# EAGLE design MineralFire-0.3-smd (EAGLE 8.7.0)
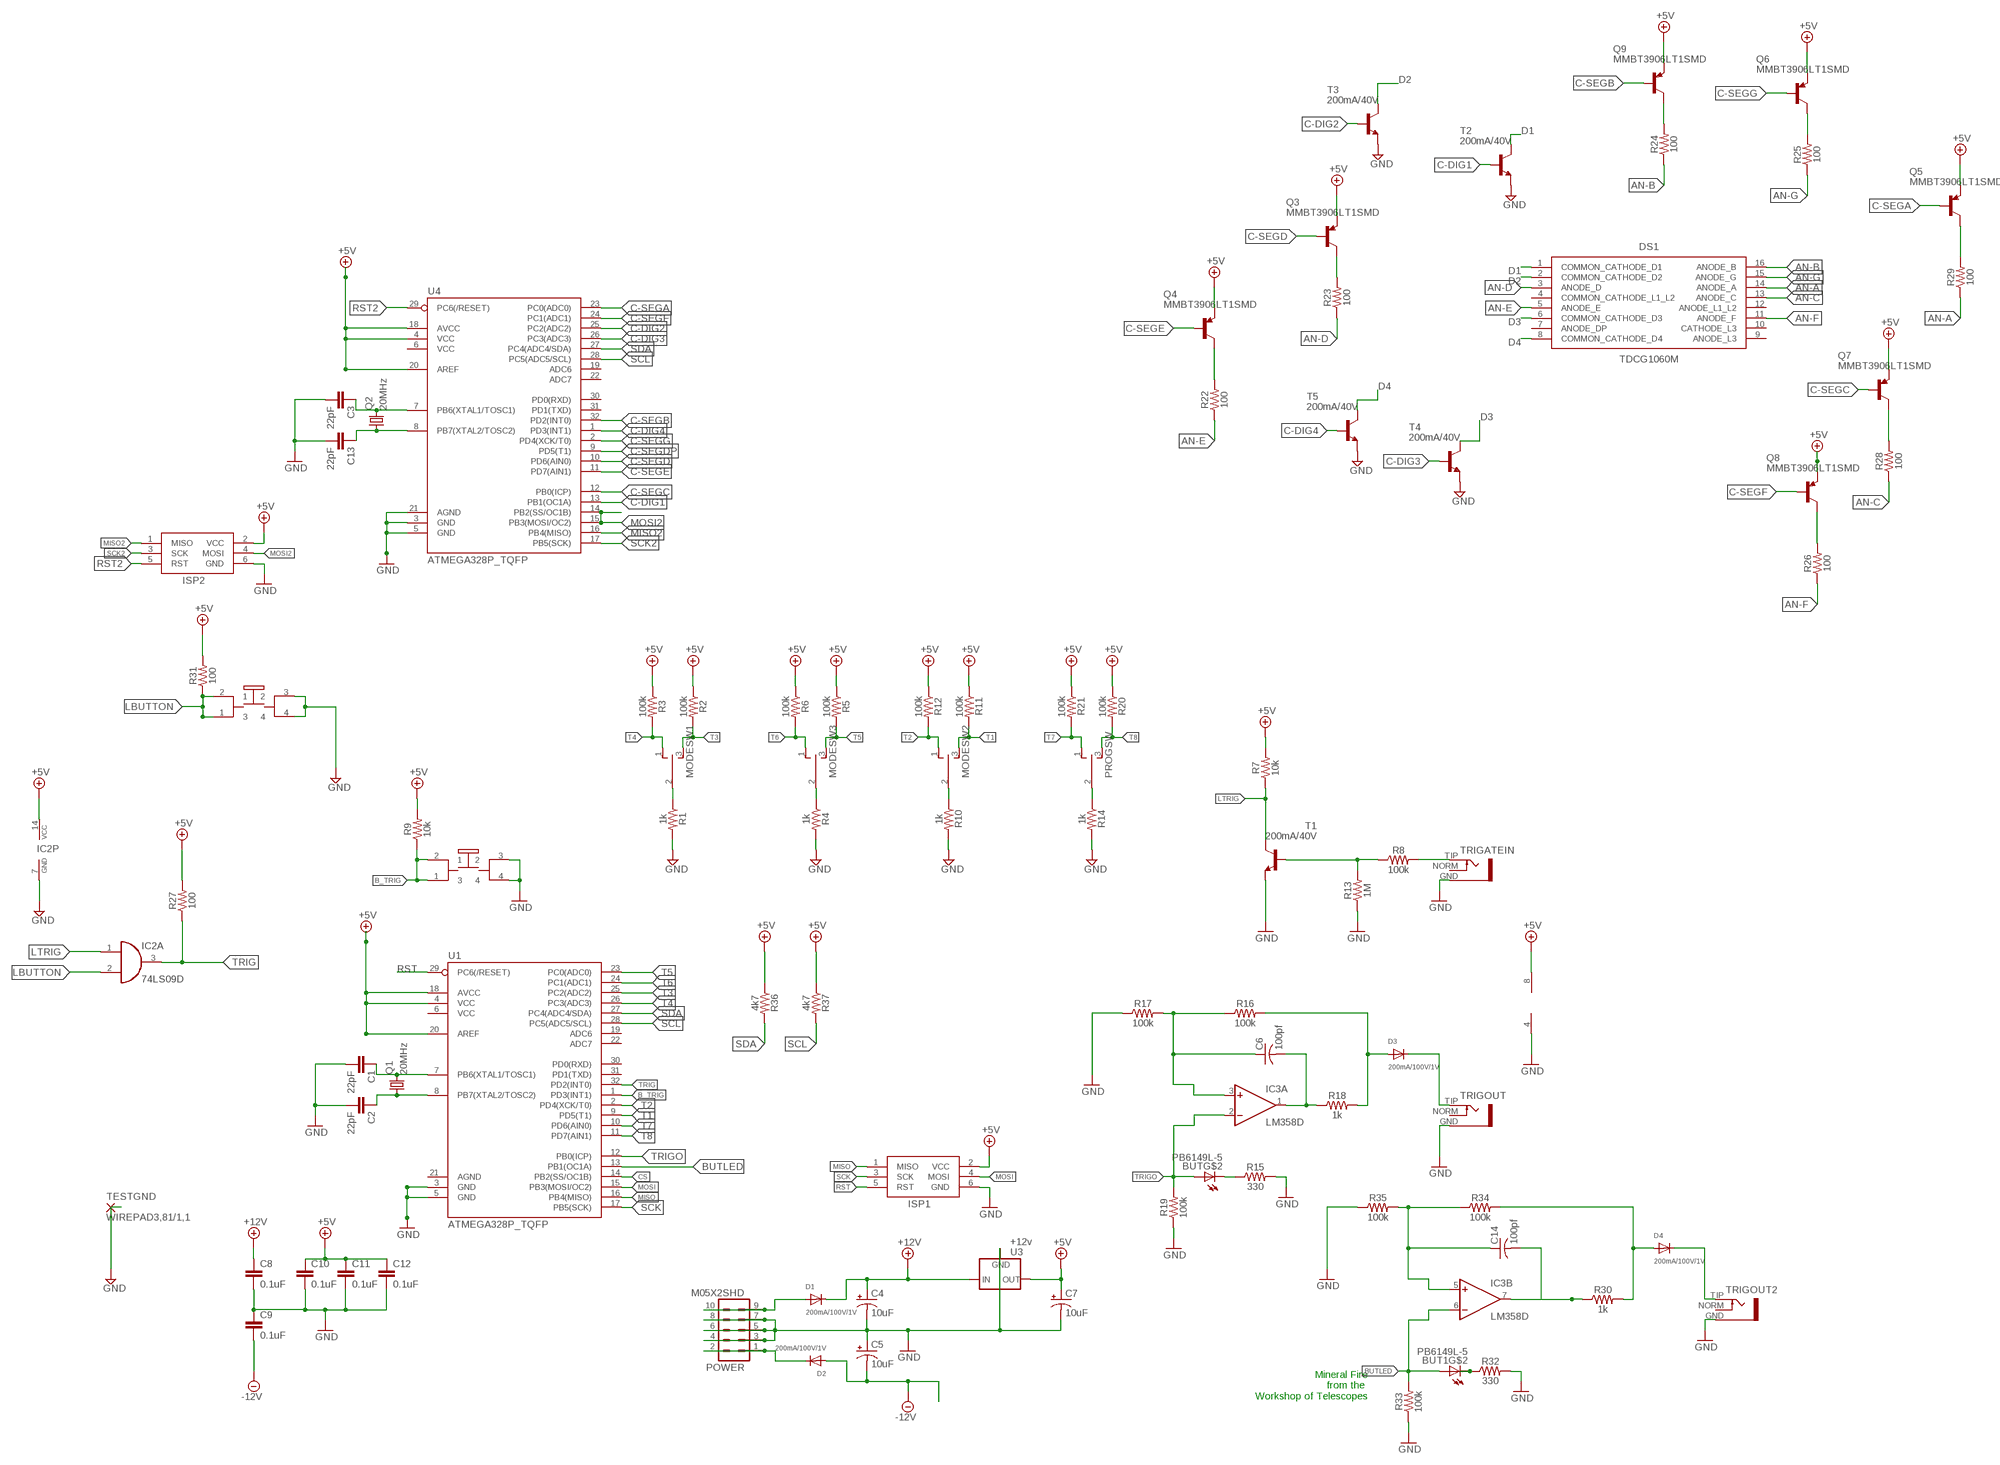
[diagram p0: schematic, sheet 1]

## Parts
BUT  PB6149L-5  [PB6149L]
BUT1  PB6149L-5  [PB6149L]
C1  22pF  22PF-0603-50V-5%  [0603]
C2  22pF  22PF-0603-50V-5%  [0603]
C3  22pF  22PF-0603-50V-5%  [0603]
C4  10uF  CPOL-US153CLV-0505  [153CLV-0505]
C5  10uF  CPOL-US153CLV-0505  [153CLV-0505]
C6  100pf  C-USC0805K  [C0805K]
C7  10uF  CPOL-US153CLV-0505  [153CLV-0505]
C8  0.1uF  0.1UF-0603-100V-10%  [0603]
C9  0.1uF  0.1UF-0603-100V-10%  [0603]
C10  0.1uF  0.1UF-0603-100V-10%  [0603]
C11  0.1uF  0.1UF-0603-100V-10%  [0603]
C12  0.1uF  0.1UF-0603-100V-10%  [0603]
C13  22pF  22PF-0603-50V-5%  [0603]
C14  100pf  C-USC0805K  [C0805K]
D1  200mA/100V/1V  DIODESMA  [SMADIODE]
D2  200mA/100V/1V  DIODESMA  [SMADIODE]
D3  200mA/100V/1V  DIODESMA  [SMADIODE]
D4  200mA/100V/1V  DIODESMA  [SMADIODE]
DS1  TDCG1060M  [DIPS1016W50P254L4020H700Q16N]
IC2  74LS09D  [SO14]
IC3  LM358D  [SO08]
ISP1  AVRISP-6  [AVRISP]
ISP2  AVRISP-6  [AVRISP]
MODESW1  TOGGLE_ON_OFF_ON  [TOGGLE_ON_OFF_ON]
MODESW2  TOGGLE_ON_OFF_ON  [TOGGLE_ON_OFF_ON]
MODESW3  TOGGLE_ON_OFF_ON  [TOGGLE_ON_OFF_ON]
POWER  M05X2SHD  [2X5-SHROUDED]
PROGSW  TOGGLE_ON_OFF_ON  [TOGGLE_ON_OFF_ON]
Q1  20MHz  CRYSTALHC49UP  [HC49UP]
Q2  20MHz  CRYSTALHC49UP  [HC49UP]
Q3  MMBT3906LT1SMD  [SOT23-BEC]
Q4  MMBT3906LT1SMD  [SOT23-BEC]
Q5  MMBT3906LT1SMD  [SOT23-BEC]
Q6  MMBT3906LT1SMD  [SOT23-BEC]
Q7  MMBT3906LT1SMD  [SOT23-BEC]
Q8  MMBT3906LT1SMD  [SOT23-BEC]
Q9  MMBT3906LT1SMD  [SOT23-BEC]
R1  1k  1KOHM-0603-1/10W-1%  [0603]
R2  100k  100KOHM-0603-1/10W-1%  [0603]
R3  100k  100KOHM-0603-1/10W-1%  [0603]
R4  1k  1KOHM-0603-1/10W-1%  [0603]
R5  100k  100KOHM-0603-1/10W-1%  [0603]
R6  100k  100KOHM-0603-1/10W-1%  [0603]
R7  10k  10KOHM-0603-1/10W-1%  [0603]
R8  100k  100KOHM-0603-1/10W-1%  [0603]
R9  10k  10KOHM-0603-1/10W-1%  [0603]
R10  1k  1KOHM-0603-1/10W-1%  [0603]
R11  100k  100KOHM-0603-1/10W-1%  [0603]
R12  100k  100KOHM-0603-1/10W-1%  [0603]
R13  1M  1MOHM-0603-1/4W-5%  [0603]
R14  1k  1KOHM-0603-1/10W-1%  [0603]
R15  330  330OHM-0603-1/10W-1%  [0603]
R16  100k  100KOHM-0603-1/10W-1%  [0603]
R17  100k  100KOHM-0603-1/10W-1%  [0603]
R18  1k  1KOHM-0603-1/10W-1%  [0603]
R19  100k  100KOHM-0603-1/10W-1%  [0603]
R20  100k  100KOHM-0603-1/10W-1%  [0603]
R21  100k  100KOHM-0603-1/10W-1%  [0603]
R22  100  100OHM-0603-1/10W-1%  [0603]
R23  100  100OHM-0603-1/10W-1%  [0603]
R24  100  100OHM-0603-1/10W-1%  [0603]
R25  100  100OHM-0603-1/10W-1%  [0603]
R26  100  100OHM-0603-1/10W-1%  [0603]
R27  100  100OHM-0603-1/10W-1%  [0603]
R28  100  100OHM-0603-1/10W-1%  [0603]
R29  100  100OHM-0603-1/10W-1%  [0603]
R30  1k  1KOHM-0603-1/10W-1%  [0603]
R31  100  100OHM-0603-1/10W-1%  [0603]
R32  330  330OHM-0603-1/10W-1%  [0603]
R33  100k  100KOHM-0603-1/10W-1%  [0603]
R34  100k  100KOHM-0603-1/10W-1%  [0603]
R35  100k  100KOHM-0603-1/10W-1%  [0603]
R36  4k7  1KOHM-0603-1/10W-1%  [0603]
R37  4k7  1KOHM-0603-1/10W-1%  [0603]
T1  200mA/40V  MMBT3904LT1-NPN-SOT23-BEC  [SOT23-BEC]
T2  200mA/40V  MMBT3904LT1-NPN-SOT23-BEC  [SOT23-BEC]
T3  200mA/40V  MMBT3904LT1-NPN-SOT23-BEC  [SOT23-BEC]
T4  200mA/40V  MMBT3904LT1-NPN-SOT23-BEC  [SOT23-BEC]
T5  200mA/40V  MMBT3904LT1-NPN-SOT23-BEC  [SOT23-BEC]
TESTGND  WIREPAD3,81/1,1  [3,81/1,1]
TRIGATEIN  S_JACK  [S_JACK]
TRIGOUT  S_JACK  [S_JACK]
TRIGOUT2  S_JACK  [S_JACK]
U1  ATMEGA328P_TQFP  [TQFP32-08]
U3  +12v  V_REG_78XX7812  [TO-252]
U4  ATMEGA328P_TQFP  [TQFP32-08]

## Nets
+5V [Power]: C7.+ C10.1 C11.1 C12.1 IC2.14(P:VCC) IC3.8(P:V+) ISP1.2(VCC) ISP2.2(VCC) Q3.E Q4.E Q5.E Q6.E Q7.E Q8.E Q9.E R2.1 R3.1 R5.1 R6.1 R7.2 R9.2 R11.1 R12.1 R20.1 R21.1 R27.2 R31.2 R36.1 R37.1 U1.4(VCC) U1.18(AVCC) U1.20(AREF) U3.2(OUT) U4.4(VCC) U4.18(AVCC) U4.20(AREF)
+12V [Power]: C4.+ C8.1 D1.C U3.1(IN)
-12V [Power]: C5.- C9.2 D2.A
AN-A: DS1.14(ANODE_A) R29.1
AN-B: DS1.16(ANODE_B) R24.1
AN-C: DS1.13(ANODE_C) R28.1
AN-D: DS1.3(ANODE_D) R23.1
AN-E: DS1.5(ANODE_E) R22.1
AN-F: DS1.11(ANODE_F) R26.1
AN-G: DS1.15(ANODE_G) R25.1
B_TRIG: BUT.1 BUT.2 R9.1 U1.1(PD3(INT1))
BUTLED: BUT1.A IC3.6(B:-IN) R33.2 U1.13(PB1(OC1A))
C-DIG1: T2.B U4.13(PB1(OC1A))
C-DIG2: T3.B U4.25(PC2(ADC2))
C-DIG3: T4.B U4.26(PC3(ADC3))
C-DIG4: T5.B U4.1(PD3(INT1))
C-SEGA: Q5.B U4.23(PC0(ADC0))
C-SEGB: Q9.B U4.32(PD2(INT0))
C-SEGC: Q7.B U4.12(PB0(ICP))
C-SEGD: Q3.B U4.10(PD6(AIN0))
C-SEGDP: U4.9(PD5(T1))
C-SEGE: Q4.B U4.11(PD7(AIN1))
C-SEGF: Q8.B U4.24(PC1(ADC1))
C-SEGG: Q6.B U4.2(PD4(XCK/T0))
CS: U1.14(PB2(SS/OC1B))
D1: DS1.1(COMMON_CATHODE_D1) T2.C
D2: DS1.2(COMMON_CATHODE_D2) T3.C
D3: DS1.6(COMMON_CATHODE_D3) T4.C
D4: DS1.8(COMMON_CATHODE_D4) T5.C
GND [Power]: BUT1.3 BUT1.4 BUT.3 BUT.4 C1.2 C2.2 C3.2 C4.- C5.+ C7.- C8.2 C9.1 C10.2 C11.2 C12.2 C13.2 IC2.7(P:GND) IC3.4(P:V-) ISP1.6(GND) ISP2.6(GND) POWER.3 POWER.4 POWER.5 POWER.6 POWER.7 POWER.8 R1.2 R4.2 R10.2 R13.1 R14.2 R15.2 R17.1 R19.1 R32.2 R33.1 R35.1 T1.E T2.E T3.E T4.E T5.E TESTGND.1(P) TRIGATEIN.GND TRIGOUT2.GND TRIGOUT.GND U1.3(GND) U1.5(GND) U3.3(GND) U4.3(GND) U4.5(GND) U4.21(AGND)
LBUTTON [Power]: BUT1.1 BUT1.2 IC2.2(A:I1) R31.1
LTRIG: IC2.1(A:I0) R7.1 T1.C
MISO: ISP1.1(MISO) U1.16(PB4(MISO))
MISO2: ISP2.1(MISO) U4.16(PB4(MISO))
MOSI: ISP1.4(MOSI) U1.15(PB3(MOSI/OC2))
MOSI2: ISP2.4(MOSI) U4.14(PB2(SS/OC1B)) U4.15(PB3(MOSI/OC2))
N$1: C1.1 Q1.2 U1.7(PB6(XTAL1/TOSC1))
N$2: C2.1 Q1.1 U1.8(PB7(XTAL2/TOSC2))
N$3: MODESW1.2(P) R1.1
N$4: MODESW3.2(P) R4.1
N$5: Q4.C R22.2
N$6: PROGSW.2(P) R14.1
N$7: C3.1 Q2.2 U4.7(PB6(XTAL1/TOSC1))
N$8: C13.1 Q2.1 U4.8(PB7(XTAL2/TOSC2))
N$9: D1.A POWER.9 POWER.10
N$10: D2.C POWER.1 POWER.2
N$11: Q3.C R23.2
N$12: MODESW2.2(P) R10.1
N$13: Q9.C R24.2
N$14: Q8.C R26.2
N$15: R8.1 R13.2 T1.B
N$16: Q7.C R28.2
N$17: Q6.C R25.2
N$18: R8.2 TRIGATEIN.TIP
N$19: IC3.7(B:OUT) R30.1
N$20: Q5.C R29.2
N$21: BUT1.K(C) R32.1
N$22: D4.A R30.2
N$23: D4.C TRIGOUT2.TIP
N$24: C14.1 IC3.5(B:+IN) R34.1 R35.2
N$25: C14.2
N$26: R34.2
N$31: BUT.K(C) R15.1
N$32: C6.1 IC3.3(A:+IN) R16.1 R17.2
N$33: C6.2 IC3.1(A:OUT) R18.1
N$34: D3.A R16.2 R18.2
N$74: D3.C TRIGOUT.TIP
RST: ISP1.5(RST) U1.29(PC6(/RESET))
RST2: ISP2.5(RST) U4.29(PC6(/RESET))
SCK: ISP1.3(SCK) U1.17(PB5(SCK))
SCK2: ISP2.3(SCK) U4.17(PB5(SCK))
SCL: R37.2 U1.28(PC5(ADC5/SCL)) U4.28(PC5(ADC5/SCL))
SDA: R36.2 U1.27(PC4(ADC4/SDA)) U4.27(PC4(ADC4/SDA))
T1: MODESW2.3(S) R11.2 U1.9(PD5(T1))
T2: MODESW2.1(O) R12.2 U1.2(PD4(XCK/T0))
T3: MODESW1.3(S) R2.2 U1.25(PC2(ADC2))
T4: MODESW1.1(O) R3.2 U1.26(PC3(ADC3))
T5: MODESW3.3(S) R5.2 U1.23(PC0(ADC0))
T6: MODESW3.1(O) R6.2 U1.24(PC1(ADC1))
T7: PROGSW.1(O) R21.2 U1.10(PD6(AIN0))
T8: PROGSW.3(S) R20.2 U1.11(PD7(AIN1))
TRIG: IC2.3(A:O) R27.1 U1.32(PD2(INT0))
TRIGO: BUT.A IC3.2(A:-IN) R19.2 U1.12(PB0(ICP))
Unconnected: DS1.4(COMMON_CATHODE_L1_L2) DS1.7(ANODE_DP) DS1.9(ANODE_L3) DS1.10(CATHODE_L3) DS1.12(ANODE_L1_L2) IC2.4(B:I0) IC2.5(B:I1) IC2.6(B:O) IC2.8(C:O) IC2.9(C:I0) IC2.10(C:I1) IC2.11(D:O) IC2.12(D:I0) IC2.13(D:I1) TRIGATEIN.NORM TRIGOUT2.NORM TRIGOUT.NORM U1.6(VCC) U1.19(ADC6) U1.21(AGND) U1.22(ADC7) U1.30(PD0(RXD)) U1.31(PD1(TXD)) U4.6(VCC) U4.19(ADC6) U4.22(ADC7) U4.30(PD0(RXD)) U4.31(PD1(TXD))

## Notes on the sheet
- Mineral Fire
  from the 
  Workshop of Telescopes

## Library data of the parts
BUT BUT1 = INSTRUO:PB6149L-5
C1-C3 C13 = SparkFun-Capacitors:22PF: 22pF ceramic capacitors A capacitor is a passive two-terminal electrical component used to store electrical energy temporarily in an electric field.; PROD_ID: CAP-07876
C4 C5 C7 = rcl:CPOL-US: POLARIZED CAPACITOR, American symbol; SPICEPREFIX: C
C6 C14 = rcl:C-US: CAPACITOR, American symbol; SPICEPREFIX: C
C8-C12 = SparkFun-Capacitors:0.1UF: 0.1µF ceramic capacitors A capacitor is a passive two-terminal electrical component used to store electrical energy temporarily in an electric field.; PROD_ID: CAP-08390
D1-D4 = adafruit:DIODE: Diode SMADIODE - SMA Surface Mount Package 20V 1A Schottky Diode Digikey: 641-1014-6-ND DO-1N4148 - Through Hole Small Current Diode SOD-123 20V 1 A (.5mV Vf) Schottky Diode - Digikey: MBRX120TPMSCT-ND SOD-323 10V 570mA (.38mV Vf, 3ns) Schottky Diode - Digikey: ZLLS410CT-ND SOD-523 30V 30mA Schottky Diode (RB751S-40TE61) - Digikey: RB751S-40TE61CT-ND SOT23-R/W - SOT23 Package (R = Solder Paste/Reflow Ovens, W = Hand-Soldering) BAT54Film 40V 300mA - Digikey: 497-7162-1-ND
DS1 = TDCG1060M:TDCG1060M: VISHAY - TDCG1060M - DISPLAY, SEVEN SEGMENT, 10MM, GREEN <https://componentsearchengine.com/Images/1/TDCG1060M.jpg> Source: Datasheet <http://www.mouser.com/ds/2/427/tdc10m-88849.pdf>; DESCRIPTION: VISHAY - TDCG1060M - DISPLAY, SEVEN SEGMENT, 10MM, GREEN; HEIGHT: 7mm; MANUFACTURER_NAME: Vishay; MANUFACTURER_PART_NUMBER: TDCG1060M; RS_PART_NUMBER: 8187530P; SUPPLIER_NAME: RS
IC2 = 74xx-eu:74*09: Quad 2-input AND gate, open collector
IC3 = linear:LM358: OP AMP also LM158; LM258; LM2904 Source: http://cache.national.com/ds/LM/LM158.pdf
ISP1 ISP2 = adafruit:AVRISP: AVR ISP HEADER Standard 6 pin header for AVR programming
MODESW1-MODESW3 PROGSW = INSTRUO:TOGGLE_ON_OFF_ON
POWER = SparkFun-Connectors:M05X2: Header 5x2 Standard 10-pin dual row 0.1" header. Commonly used with AVR-ISP. Use with Spark Fun Electronics SKU: PRT-00778
Q1 Q2 = adafruit:CRYSTAL: CRYSTAL; OC_FARNELL: unknown; OC_NEWARK: unknown
Q3-Q9 = transistor-pnp:MMBT3906*: PNP Transistror
R1 R4 R10 R14 R18 R30 = SparkFun-Resistors:1KOHM: 1kΩ resistor A resistor is a passive two-terminal electrical component that implements electrical resistance as a circuit element. Resistors act to reduce current flow, and, at the same time, act to lower voltage levels within circuits. - Wikipedia; PROD_ID: RES-07856
R2 R3 R5 R6 R8 R11 R12 R16 R17 R19-R21 R33-R35 = SparkFun-Resistors:100KOHM: 100kΩ resistor A resistor is a passive two-terminal electrical component that implements electrical resistance as a circuit element. Resistors act to reduce current flow, and, at the same time, act to lower voltage levels within circuits. - Wikipedia; PROD_ID: RES-07828
R7 R9 = SparkFun-Resistors:10KOHM: 10kΩ resistor A resistor is a passive two-terminal electrical component that implements electrical resistance as a circuit element. Resistors act to reduce current flow, and, at the same time, act to lower voltage levels within circuits. - Wikipedia; PROD_ID: RES-00824
R13 = SparkFun-Resistors:1MOHM: 1MΩ resistor A resistor is a passive two-terminal electrical component that implements electrical resistance as a circuit element. Resistors act to reduce current flow, and, at the same time, act to lower voltage levels within circuits. - Wikipedia; PROD_ID: RES-07868
R15 R32 = SparkFun-Resistors:330OHM: 330Ω resistor A resistor is a passive two-terminal electrical component that implements electrical resistance as a circuit element. Resistors act to reduce current flow, and, at the same time, act to lower voltage levels within circuits. - Wikipedia; PROD_ID: RES-00818
R22-R29 R31 = SparkFun-Resistors:100OHM: 100Ω resistor A resistor is a passive two-terminal electrical component that implements electrical resistance as a circuit element. Resistors act to reduce current flow, and, at the same time, act to lower voltage levels within circuits. - Wikipedia; PROD_ID: RES-07863
R36 R37 = SparkFun-Resistors:1KOHM: 1kΩ resistor A resistor is a passive two-terminal electrical component that implements electrical resistance as a circuit element. Resistors act to reduce current flow, and, at the same time, act to lower voltage levels within circuits. - Wikipedia; PROD_ID: RES-07856; VALUE: 1k
T1-T5 = transistor:*-NPN-: NPN Transistror BF959 corrected 2008.03.06
TESTGND = wirepad:WIREPAD: Wire PAD connect wire on PCB
TRIGATEIN TRIGOUT TRIGOUT2 = INSTRUO:S_JACK
U1 U4 = SparkFun-IC-Microcontroller:ATMEGA328P_TQFP: Popular 328P in QFP Storefront component: ATmega328 - TQFP (COM-13448) Datasheet SparkFun Products SparkFun RedBoard - Programmed with Arduino (DEV-12757) Arduino Pro Mini 328 - 5V/16MHz (DEV-11113) Arduino Pro Mini 328 - 3.3V/8MHz (DEV-11114) SparkFun OpenLog (DEV-13712) SparkFun MicroView - OLED Arduino Module (DEV-12923) SparkFun Digital Sandbox (DEV-12651) SparkFun PicoBoard (WIG-11888) Arduino Fio (DEV-10116) LilyPad Arduino 328 Main Board (DEV-13342) SparkFun RedStick (DEV-13741) LilyPad MP3 (DEV-11013) LilyPad Arduino SimpleSnap (DEV-10941) SparkFun Stepoko (ROB-13899) SparkFun Geiger Counter (SEN-11345) SparkFun EL Sequencer (COM-12781) Arduino Pro 328 - 5V/16MHz (DEV-10915) CryptoCape (DEV-12773) SparkFun IR Thermometer Evaluation Board - MLX90614 (SEN-10740) SparkFun RedBot Mainboard (ROB-12097) Arduino Pro 328 - 3.3V/8MHz (DEV-10914) SparkFun Block for Intel® Edison - Arduino (DEV-13036) SparkFun Simon Says - Surface Mount Soldering Kit (KIT-10935) SparkFun 7-Segment Serial Display - Red (COM-11441) SparkFun 7-Segment Serial Display - White (COM-11629) SparkFun 7-Segment Serial Display - Yellow (COM-11443) SparkFun 7-Segment Serial Display - Kelly Green (COM-11440) SparkFun 7-Segment Serial Display - Blue (COM-11442) SparkFun OpenSegment Serial Display - 20mm (Blue) (COM-11647) SparkFun OpenSegment Serial Display - 20mm (Green) (COM-11646) SparkFun OpenSegment Serial Display - 20mm (White) (COM-11648) SparkFun OpenSegment Serial Display - 20mm (Red) (COM-11644) SparkFun OpenSegment Serial Display - 20mm (Yellow) (COM-11645) SparkFun OpenSegment Shield (DEV-13190); PROD_ID: IC-09069
U3 = SparkFun-IC-Power:V_REG_78XX: Voltage Regulator Standard 78xx regulator. IGO (Input Ground Output). Spark Fun Electronics SKU : COM-00107; PROD_ID: VREG-12370

## Net classes
1 Power: width 0.8 mm

## Board
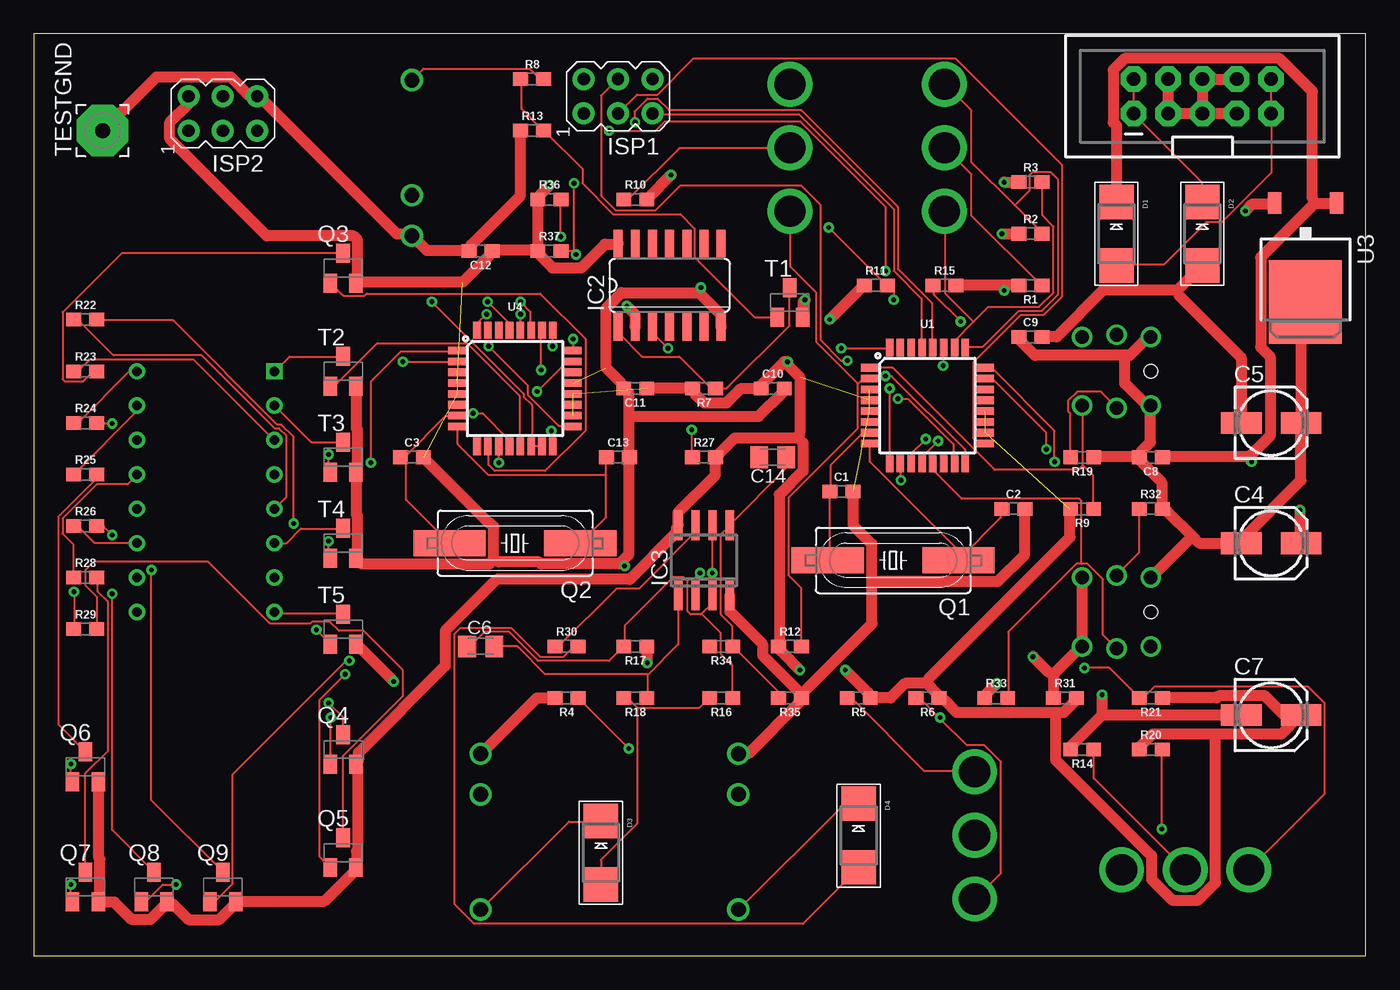
[diagram p1: board, top side]
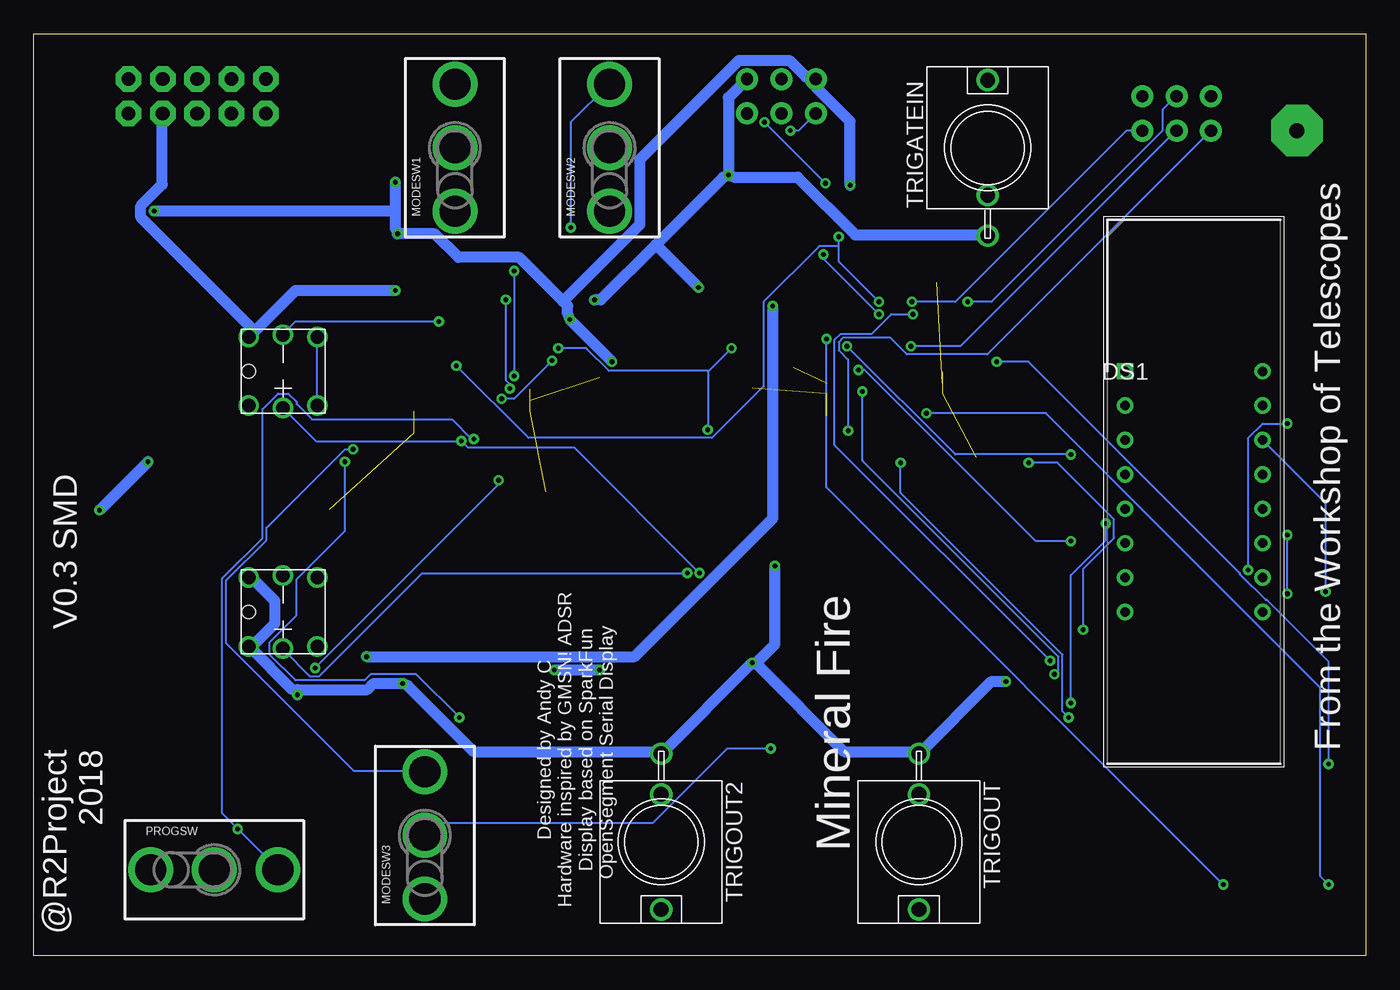
[diagram p2: board, bottom side, seen from below]

Size 98.43 x 68.11 mm. Coordinates in mm from the lower left corner, seen from the top.
Outline: 0,0 98.43,0 98.43,68.11 0,68.11 0,0
Copper layers (1*16): Top 0.035mm / dielectric 1.5mm / Bottom 0.035mm
Design rules "default": minimum track width 6mil, minimum drill 0.35mm, track to track 6mil, track to pad 6mil, pad to pad 6mil, via to via 6mil, smd to smd 6mil, copper to edge 40mil, drill to drill 6mil, minimum pad ring 10mil, minimum via ring 8mil, stop-mask expansion 4mil, vias tented up to drill 0mil, thermal gap 10mil

### Footprints (pad centres in the part's own frame; a part is rotated, then mirrored left to right if it is on the bottom)
PB6149L = drill 1: 1 2.54,-2.54; 2 2.54,2.54; 3 -2.54,-2.54; 4 -2.54,2.54; A 0,-2.7; K 0,2.7 | hole 1: -2.54,0
0603 = smd 1.1 x 1: 1 -0.85,0; 2 0.85,0
153CLV-0505 = smd 3 x 1.6: + 2.2,0; - -2.2,0
C0805K = smd 1.3 x 1.6: 1 -1,0; 2 1,0
SMADIODE = smd 2.54 x 2.54: A 2.349,0; C -2.349,0
DIPS1016W50P254L4020H700Q16N = drill 0.7 pad 1.1 square: 1 0,0 | drill 0.7 pad 1.1: 2 0,-2.54; 3 0,-5.08; 4 0,-7.62; 5 0,-10.16; 6 0,-12.7; 7 0,-15.24; 8 0,-17.78; 9 10.16,-17.78; 10 10.16,-15.24; 11 10.16,-12.7; 12 10.16,-10.16; 13 10.16,-7.62; 14 10.16,-5.08; 15 10.16,-2.54; 16 10.16,0
SO14 = smd 0.66 x 2.032: 1 -3.81,-3.073; 2 -2.54,-3.073; 3 -1.27,-3.073; 4 0,-3.073; 5 1.27,-3.073; 6 2.54,-3.073; 7 3.81,-3.073; 8 3.81,3.073; 9 2.54,3.073; 10 1.27,3.073; 11 0,3.073; 12 -1.27,3.073; 13 -2.54,3.073; 14 -3.81,3.073
SO08 = smd 0.6 x 2.2: 1 -1.905,-2.6; 2 -0.635,-2.6; 3 0.635,-2.6; 4 1.905,-2.6; 5 1.905,2.6; 6 0.635,2.6; 7 -0.635,2.6; 8 -1.905,2.6
AVRISP = drill 0.9 pad 1.626: 1 -1.27,2.54; 2 1.27,2.54; 3 -1.27,0; 4 1.27,0; 5 -1.27,-2.54; 6 1.27,-2.54
TOGGLE_ON_OFF_ON = drill 2.3: 1 -4.7,0; 2 0,0; 3 4.7,0
2X5-SHROUDED = drill 1.016 pad 1.88 octagon: 1 -1.27,5.08; 2 1.27,5.08; 3 -1.27,2.54; 4 1.27,2.54; 5 -1.27,0; 6 1.27,0; 7 -1.27,-2.54; 8 1.27,-2.54; 9 -1.27,-5.08; 10 1.27,-5.08
HC49UP = smd 5.334 x 1.93: 1 -4.826,0; 2 4.826,0
SOT23-BEC = smd 1 x 1.4: B -0.95,-1.1; C 0,1.1; E 0.95,-1.1
3,81/1,1 = drill 1.118 pad 3.81 octagon: 1 0,0
S_JACK = drill 1.1: GND 0,-6.5; NORM 0,-3.5; TIP 0,5
TQFP32-08 = smd 1.27 x 0.559: 1 -4.293,2.8; 2 -4.293,2; 3 -4.293,1.2; 4 -4.293,0.4; 5 -4.293,-0.4; 6 -4.293,-1.2; 7 -4.293,-2; 8 -4.293,-2.8; 17 4.293,-2.8; 18 4.293,-2; 19 4.293,-1.2; 20 4.293,-0.4; 21 4.293,0.4; 22 4.293,1.2; 23 4.293,2; 24 4.293,2.8 | smd 0.559 x 1.27: 9 -2.8,-4.293; 10 -2,-4.293; 11 -1.2,-4.293; 12 -0.4,-4.293; 13 0.4,-4.293; 14 1.2,-4.293; 15 2,-4.293; 16 2.8,-4.293; 25 2.8,4.293; 26 2,4.293; 27 1.2,4.293; 28 0.4,4.293; 29 -0.4,4.293; 30 -1.2,4.293; 31 -2,4.293; 32 -2.8,4.293
TO-252 = smd 1 x 1.6: 1 -2.28,-4.8; 2 2.28,-4.8 | smd 5.4 x 6.2: 3 0,2.5

### Placement (x,y rotation side)
BUT  80.01,43.18 0 bottom
BUT1  80.01,25.4 0 bottom
C1  59.69,34.29 0 top
C2  72.39,33.02 0 top
C3  27.94,36.83 0 top
C4  91.44,30.48 0 top
C5  91.44,39.37 0 top
C6  33.02,22.86 0 top
C7  91.44,17.78 0 top
C8  82.55,36.83 180 top
C9  73.66,45.72 0 top
C10  54.61,41.91 0 top
C11  44.45,41.91 180 top
C12  33.02,52.07 180 top
C13  43.18,36.83 0 top
C14  54.61,36.83 180 top
D1  80.01,53.34 270 top
D2  86.36,53.34 270 top
D3  41.91,7.62 270 top
D4  60.96,8.89 270 top
DS1  17.78,43.18 0 bottom
IC2  46.99,49.53 0 top
IC3  49.53,29.21 0 top
ISP1  43.18,63.5 90 top
ISP2  13.97,62.23 90 top
MODESW1  67.31,59.69 90 bottom
MODESW2  55.88,59.69 90 bottom
MODESW3  69.53,8.89 90 bottom
POWER  86.36,63.5 90 top
PROGSW  85.09,6.35 0 bottom
Q1  63.5,29.21 180 top
Q2  35.56,30.48 180 top
Q3  22.86,50.8 0 top
Q4  22.86,15.24 0 top
Q5  22.86,7.62 0 top
Q6  3.81,13.97 0 top
Q7  3.81,5.08 0 top
Q8  8.89,5.08 0 top
Q9  13.97,5.08 0 top
R1  73.66,49.53 180 top
R2  73.66,53.34 0 top
R3  73.66,57.15 0 top
R4  39.37,19.05 180 top
R5  60.96,19.05 180 top
R6  66.04,19.05 180 top
R7  49.53,41.91 180 top
R8  36.83,64.77 0 top
R9  77.47,33.02 180 top
R10  44.45,55.88 0 top
R11  62.23,49.53 0 top
R12  55.88,22.86 0 top
R13  36.83,60.96 0 top
R14  77.47,15.24 180 top
R15  67.31,49.53 0 top
R16  50.8,19.05 180 top
R17  44.45,22.86 180 top
R18  44.45,19.05 180 top
R19  77.47,36.83 180 top
R20  82.55,15.24 0 top
R21  82.55,19.05 180 top
R22  3.81,46.99 0 top
R23  3.81,43.18 0 top
R24  3.81,39.37 0 top
R25  3.81,35.56 0 top
R26  3.81,31.75 0 top
R27  49.53,36.83 0 top
R28  3.81,27.94 0 top
R29  3.81,24.13 0 top
R30  39.37,22.86 0 top
R31  76.2,19.05 0 top
R32  82.55,33.02 0 top
R33  71.12,19.05 0 top
R34  50.8,22.86 180 top
R35  55.88,19.05 180 top
R36  38.1,55.88 0 top
R37  38.1,52.07 0 top
T1  55.88,48.26 0 top
T2  22.86,43.18 0 top
T3  22.86,36.83 0 top
T4  22.86,30.48 0 top
T5  22.86,24.13 0 top
TESTGND  5.08,60.96 90 top
TRIGATEIN  27.94,59.69 0 bottom
TRIGOUT  33.02,8.42 180 bottom
TRIGOUT2  52.07,8.42 180 bottom
U1  66.04,40.64 0 top
U3  93.98,50.8 180 top
U4  35.56,41.91 0 top

### Tracks (layer width: path | path; a pad name or v marks a point on that pad's centre or on a via)
+5V  (via drill 0.35)  (6 unrouted)
  Top 0.8: 87.33,16.38 92.2,16.38 93.57,17.75 C7.+ 92.73,17.45 90.98,19.2 87.55,19.2 87.4,19.05 R21.1 | 87.33,16.38 82.68,16.38 81.76,15.47 81.76,15.24 R20.1 | 65.99,20.12 64.39,20.12 63.32,19.05 R5.1 61.65,19.43 v59.97,21.11 | 65.99,20.12 66.83,19.28 66.83,19.05 R6.1 67.28,18.9 68.2,17.98 75.51,17.98 | R9.2 76.58,32.99 76.58,30.94 66.14,20.5 65.99,20.12 | 75.51,17.98 76.12,17.98 77.04,18.9 77.04,19.05 R31.2 | 87.33,16.38 87.33,5.41 86.03,4.12 84.12,4.12 82.6,5.64 82.6,7.39 75.51,14.48 75.51,17.98 | R37.1 37.19,52.12 33.91,52.12 C12.1 33.68,51.74 31.7,49.76 23.85,49.76 Q3.E 23.93,50.14 23.93,52.88 23.62,53.19 17.22,53.19 10.06,60.35 10.06,61.57 11.43,62.94 ISP2.2 | R37.1 37.26,52.5 37.26,55.85 R36.1 37.41,56.24 v38.1,56.92 | IC2.14 43.13,52.58 42.22,52.58 40.46,50.83 38.33,50.83 37.41,51.74 R37.1 | Q6.E 4.8,12.8 4.8,7.24 4.88,7.16 4.88,4.34 Q7.E 4.8,3.96 5.94,3.96 7.24,2.67 8.61,2.67 9.91,3.96 Q8.E 10.29,3.81 11.43,2.67 13.72,2.67 14.86,3.81 14.86,3.96 Q9.E 15.32,4.04 21.49,4.04 23.62,6.17 Q5.E 23.85,6.55 23.85,7.7 23.93,7.77 23.93,14.02 23.85,14.1 Q4.E 24,14.48 24,15.01 30.4,21.41 30.4,24 34.21,27.81 44.04,27.81 47.47,31.24 47.47,31.47 IC3.8 47.62,32.77 50.37,35.51 50.37,36.8 R27.2 50.67,37.11 51.82,38.25 56.46,38.25 | 56.46,38.25 56.84,37.87 56.84,35.81 55.09,34.06 55.09,22.86 R12.1 55.24,22.48 v56.62,21.11 | C11.1 R7.2 48.84,41.53 49.53,40.84 51.21,40.84 52.27,41.91 C10.1 53.87,42.29 55.47,43.89 v55.7,43.89 55.85,43.51 56.62,42.75 56.62,38.63 56.46,38.25 | v58.83,47.02 61.34,49.53 R11.1 | v71.55,53.34 R2.1 | v71.7,57.15 R3.1 | v89.53,55.02 90.07,55.55 91.67,55.55 U3.2
  Bottom 0.8: v38.1,56.92 38.1,61.65 40.62,64.16 40.62,64.77 ISP1.2 41,64.92 41.38,64.92 42.6,66.14 46.33,66.14 53.65,58.83 53.65,54.03 59.32,48.35 | v55.7,43.89 v58.83,47.02 58.98,47.4 58.98,48.01 59.32,48.35 | 59.32,48.35 62.56,51.59 67.06,51.59 68.81,53.34 v71.55,53.34 71.7,53.72 71.7,55.02 | 71.7,55.02 v71.7,57.15 | 71.7,55.02 v89.53,55.02 | v56.62,21.11 v59.97,21.11
+12V  (via drill 0.35)
  Top 0.8: 89.84,36.88 83.44,36.88 C8.1 | 89.84,36.88 91.36,38.41 91.36,44.27 90.68,44.96 90.68,51.59 94.64,55.55 | 94.64,55.55 96.24,55.55 U3.1 | D1.C 80.01,61.34 79.78,61.57 79.78,65.46 80.62,66.29 92.05,66.29 94.49,63.86 94.49,55.93 94.64,55.55 | v93.57,32.92 93.57,30.48 C4.+ | v89.99,36.5 89.84,36.88
  Bottom 0.8: v89.99,36.5 v93.57,32.92
-12V
  Top 0.8: C9.2 75.59,45.72 79.02,49.15 84.51,49.15 | 84.51,49.15 86.33,50.98 D2.A | C5.- 89.23,39.4 89.23,44.2 84.66,48.77 84.51,49.15
AN-A  (via drill 0.35)
  Top 0.152: v2.97,26.9 2.97,24.16 R29.1
  Bottom 0.152: v2.97,26.9 2.97,33.45 DS1.14
AN-B
  Top 0.152: R24.1 2.97,39.4 3.28,39.4 7.01,43.13 7.62,43.13 DS1.16
AN-C
  Top 0.152: R28.1 2.9,27.96 2.9,30.4 2.13,31.17 2.13,32.31 4.65,34.82 6.93,34.82 7.62,35.51 DS1.13
AN-D
  Top 0.152: R23.1 2.97,43.2 3.28,43.2 4.12,44.04 11.81,44.04 17.75,38.1 DS1.3
AN-E
  Top 0.152: DS1.5 18.67,33.91 18.67,38.41 18.14,38.94 17.83,38.94 12.42,44.35 5.87,44.35 3.28,46.94 2.97,46.94 R22.1
AN-F
  Top 0.152: DS1.11 4.5,30.48 3.28,31.7 2.97,31.7 R26.1
AN-G
  Top 0.152: DS1.15 7.62,40.23 2.97,35.59 R25.1
B_TRIG
  Top 0.152: 77.53,36.23 77.5,36.27 77.5,40.62 BUT.1 | 77.53,36.23 78.26,35.51 78.26,33.07 R9.1 | 77.53,36.23 77.19,35.89 71.02,35.89 63.48,43.43 61.8,43.43 U1.1
  Bottom 0.152: BUT.2 77.5,45.72 77.5,40.69 BUT.1
BUTLED  (via drill 0.35)
  Top 0.152: 77.42,28.96 77.88,28.96 79.02,27.81 79.02,23.7 BUT1.A | 77.42,28.96 77.04,28.96 72.01,23.93 72.01,19.05 R33.2 | 77.42,28.96 77.42,33.6 77.27,33.76 68.58,33.76 66.45,35.89 U1.13 | v50.14,28.27 50.14,31.77 IC3.6
  Bottom 0.152: v50.14,28.27 69.72,28.27 77.34,20.65 78.03,20.65 80.01,22.63 BUT1.A
C-DIG1
  Top 0.152: U4.13 35.89,37.64 35.89,41.38 32,45.26 25.38,45.26 22.25,42.14 21.95,42.14 T2.B
C-DIG2  (via drill 0.35)
  Top 0.152: v38.33,45.03 38.33,46.18 U4.25 | v21.79,37.03 21.79,35.81 21.87,35.74 T3.B
  Bottom 0.152: v38.33,45.03 30.33,37.03 v21.79,37.03
C-DIG3  (via drill 0.35)
  Top 0.152: v37.49,43.28 37.49,46.18 U4.26 | v21.79,30.63 21.79,29.49 21.87,29.41 T4.B
  Bottom 0.152: v37.49,43.28 37.03,43.28 24.38,30.63 v21.79,30.63
C-DIG4  (via drill 0.35)
  Top 0.152: v24.92,36.42 24.92,42.44 27.13,44.65 31.24,44.65 U4.1 | v20.88,24.08 21.87,23.09 T5.B
  Bottom 0.152: v24.92,36.42 22.78,36.42 18.59,32.23 18.59,30.86 20.88,28.57 v20.88,24.08
C-SEGA  (via drill 0.35)
  Top 0.152: v37.19,41.68 39.4,43.89 39.85,43.89 U4.23 | v23.01,20.8 21.11,18.9 21.11,7.32 21.87,6.55 Q5.B
  Bottom 0.152: v37.19,41.68 37.19,36.58 22.71,22.1 22.71,21.11 v23.01,20.8
C-SEGB  (via drill 0.35)
  Top 0.152: v33.45,47.4 32.77,46.71 32.77,46.25 U4.32 | v23.32,21.79 23.09,21.79 14.71,13.41 14.71,5.33 13.41,4.04 13.03,4.04 Q9.B
  Bottom 0.152: v33.45,47.4 35.05,47.4 36.5,45.95 38.79,45.95 39.24,45.49 39.24,37.72 v23.32,21.79
C-SEGC  (via drill 0.35)
  Top 0.152: v32.46,40.08 33.15,40.08 35.13,38.1 35.13,37.64 U4.12 | v2.74,5.26 2.74,4.12 2.82,4.04 Q7.B
  Bottom 0.152: v32.46,40.08 23.62,40.08 3.35,19.81 3.35,5.87 v2.74,5.26
C-SEGD
  Top 0.152: U4.10 33.6,37.57 33.6,36.27 34.06,35.81 37.8,35.81 40.77,38.79 40.77,45.57 37.41,48.92 24.61,48.92 24.46,48.77 22.86,48.77 21.95,49.68 Q3.B
C-SEGE  (via drill 0.35)
  Top 0.152: v34.37,36.42 34.37,37.57 U4.11 | v21.95,17.6 21.95,14.17 Q4.B
  Bottom 0.152: v34.37,36.42 34.37,34.21 22.4,22.25 22.4,18.06 v21.95,17.6
C-SEGF  (via drill 0.35)
  Top 0.152: v39.85,45.57 U4.24 | v10.52,5.26 9.53,5.26 8.31,4.04 8,4.04 Q8.B
  Bottom 0.152: v39.85,45.57 39.85,34.59 v10.52,5.26
C-SEGG  (via drill 0.35)
  Top 0.152: v27.28,43.89 31.24,43.89 U4.2 | v2.74,14.17 2.74,12.95 2.82,12.88 Q6.B
  Bottom 0.152: v27.28,43.89 24.92,43.89 9.3,28.27 9.3,28.19 7.39,26.29 7.32,26.29 2.74,21.72 v2.74,14.17
D1
  Top 0.152: T2.C 18.9,44.27 17.83,43.2 DS1.1
D2
  Top 0.152: T3.C 22.86,37.95 20.5,37.95 17.83,40.62 DS1.2
D3
  Top 0.152: DS1.6 18.67,30.48 19.74,31.55 22.86,31.55 T4.C
D4
  Top 0.152: T5.C 22.86,25.3 17.91,25.3 17.83,25.38 DS1.8
GND  (via drill 0.35)  (5 unrouted)
  Top 0.8: R13.1 35.97,60.96 35.97,56.16 32.31,52.5 C12.2 32.16,52.12 29.03,52.12 27.96,53.19 TRIGATEIN.GND 27.58,53.34 26.82,53.34 16.84,63.32 ISP2.6 16.46,63.55 15.93,63.55 14.55,64.92 9.07,64.92 5.11,60.96 TESTGND.1 | v47.09,57.68 45.34,55.93 R10.2 | v57,48.46 56.84,48.31 56.84,47.17 T1.E | 33.98,29.26 33.98,31.7 33.68,32 33.6,32 28.8,36.8 C3.2 | 33.98,29.26 33.68,28.96 24.23,28.96 23.85,29.34 T4.E 23.93,29.72 23.93,32.54 23.85,32.61 23.85,35.66 T3.E 23.93,36.04 23.93,38.86 23.85,38.94 23.85,42.06 T2.E | 43.97,39.85 43.97,41.6 43.66,41.91 C11.2 43.43,42.29 42.29,43.43 42.29,47.85 43.43,49 49.15,49 | 43.97,39.85 43.97,36.88 C13.2 43.97,36.42 43.97,29.64 43.28,28.96 | 43.97,39.85 53.57,39.85 55.4,41.68 55.4,41.91 C10.2 | 49.15,49 50.75,47.4 50.75,46.48 IC2.7 | 43.28,28.96 37.49,28.96 37.34,29.11 34.37,29.11 33.98,29.26 | v49.3,49.38 49.15,49 | R4.2 37.19,19.05 33.07,14.94 TRIGOUT.GND | v26.59,20.27 23.85,23.01 T5.E | TRIGOUT2.GND 52.12,14.94 52.81,14.94 56.69,18.82 56.69,19.05 R35.1 56.84,19.43 | v45.34,21.64 45.34,22.86 R17.1 | 61.95,27.66 61.95,24.54 56.84,19.43 | 61.95,27.66 61.95,30.4 60.58,31.77 60.58,34.29 C1.2 | 61.95,27.66 71.25,27.66 73.23,29.64 73.23,32.99 C2.2 | IC3.4 51.44,25.45 53.87,23.01 53.87,22.17 56.46,19.58 56.84,19.43 | POWER.4 POWER.3 84.2,62.26 86.33,62.26 POWER.5 | POWER.5 86.41,62.64 86.41,64.77 POWER.6 POWER.8 | POWER.7 88.85,62.26 86.72,62.26 POWER.5 | R1.2 71.7,49.53 | 71.7,49.53 R15.2 | 80.62,44.35 81,44.35 82.37,45.72 BUT.4 | 80.62,44.35 73.99,44.35 72.85,45.49 72.85,45.72 C9.1 | v71.7,49.15 71.7,49.53 | 78.94,17.75 76.66,15.47 76.66,15.24 R14.2
  Top 0.8: 78.94,17.75 89.23,17.75 C7.- | v71.17,20.12 70.33,19.28 70.33,19.05 R33.1 | v78.94,19.28 78.94,17.75 | U3.3 93.95,48.23 93.65,47.93 93.65,39.4 C5.+ 93.65,38.94 93.65,35.13 89.38,30.86 C4.- 86.11,30.48 85.61,30.98 | R19.1 78.33,36.88 81.69,36.88 C8.2 | C8.2 81.84,36.5 83.36,34.98 83.36,33.07 R32.2 83.74,32.84 85.61,30.98 | 85.61,30.98 82.6,27.96 BUT1.4 | C8.2 81.84,37.26 82.53,37.95 82.53,40.62 BUT.3 82.14,40.77 80.62,42.29 80.62,44.35 | v43.66,28.8 43.28,28.96
  Bottom 0.8: v47.09,57.68 47.09,63.4 ISP1.6 | v57,48.46 56.54,48.46 52.46,52.54 | 52.46,52.54 47.47,57.53 v47.09,57.68 | v49.3,49.38 52.46,52.54 | TRIGATEIN.GND 27.96,53.26 37.72,53.26 41.99,57.53 46.71,57.53 v47.09,57.68 | v26.59,20.27 27.66,20.27 32.99,14.94 TRIGOUT.GND 33.38,15.09 38.56,15.09 44.96,21.49 | 44.96,21.49 v45.34,21.64 52.05,14.94 TRIGOUT2.GND 52.43,15.09 65.91,15.09 70.79,19.96 v71.17,20.12 73.3,20.12 73.76,19.66 78.94,19.66 | v71.7,49.15 79.1,49.15 82.53,45.72 BUT.4 82.37,46.41 90.53,54.56 90.53,55.4 88.92,57 88.92,62.18 POWER.7 | 78.94,19.66 79.32,19.66 82.53,22.86 BUT1.3 82.14,23.01 80.62,24.54 80.62,26.21 82.3,27.89 82.53,27.89 BUT1.4 | v78.94,19.28 78.94,19.66 | v43.66,28.8 43.66,23.01 44.81,21.87 44.96,21.49
LBUTTON  (via drill 0.35)
  Top 0.8: 75.36,20.8 75.36,19.05 R31.1 | 75.36,20.8 77.42,22.86 BUT1.1 77.5,23.24 77.5,27.89 BUT1.2 | v43.81,48.01 44.42,47.4 44.42,46.48 IC2.2 | v73.84,22.1 74.98,20.95 75.36,20.8
  Bottom 0.8: v43.81,48.01 43.81,32.31 54.03,22.1 v73.84,22.1
LTRIG
  Top 0.152: IC2.1 43.2,46.41 43.2,46.02 44.96,44.27 47.7,44.27 50.06,41.91 R7.1 51.21,41.91 55.85,46.56 55.85,49.3 T1.C
MISO  (via drill 0.35)
  Top 0.152: v62.94,42.82 63.4,42.82 68.81,37.41 68.81,36.35 U1.16 | v62.94,50.6 62.94,55.32 56.62,61.65 46.63,61.65 45.95,60.96 v42.52,60.96
  Bottom 0.152: v62.94,50.6 v62.94,42.82 | v42.52,60.96 41.91,60.96 ISP1.1
MISO2  (via drill 0.35)
  Top 0.152: v38.25,38.79 38.33,38.71 38.33,37.64 U4.16
  Bottom 0.152: v38.25,38.79 38.25,44.04 38.94,44.73 38.94,45.34 38.63,45.64 35.13,45.64 33.91,44.42 27.96,44.42 ISP2.1
MOSI  (via drill 0.35)
  Top 0.152: v63.86,41.15 64.62,41.15 67.97,37.8 67.97,36.35 U1.15 | v60.12,43.97 59.66,43.97 58.14,45.49 58.14,55.47 56.69,56.92 47.78,56.92 45.95,55.09 42.98,55.09 41.91,56.16 41.91,63.55 43.13,64.77 ISP1.4
  Bottom 0.152: v63.86,41.15 62.94,41.15 v60.12,43.97
MOSI2  (via drill 0.35)
  Top 0.152: U4.15 37.49,37.64 36.8,37.64 U4.14 36.8,37.72 36.8,40.69 36.2,41.3 36.2,41.53 v29.41,48.31
  Bottom 0.152: v29.41,48.31 27.66,48.31 15.01,60.96 15.01,62.48 14.02,63.48 ISP2.4
N$1
  Top 0.152: Q1.2 58.67,29.26 58.83,29.41 58.83,34.29 C1.1 58.9,34.29 58.9,36.27 61.27,38.63 61.72,38.63 U1.7
N$2
  Top 0.152: C2.1 71.48,32.99 71.48,32.38 68.35,29.26 Q1.1 68.66,29.64 61.8,36.5 61.8,37.8 U1.8
N$3
  Top 0.152: R1.1 74.45,49.53 69.27,54.71 69.27,57.76 67.36,59.66 MODESW1.2
N$4  (via drill 0.35)
  Top 0.152: v43.97,15.32 40.23,19.05 R4.1
  Bottom 0.152: v43.97,15.32 47.17,15.32 52.65,9.83 68.58,9.83 69.49,8.91 MODESW3.2
N$5  (via drill 0.35)
  Top 0.152: v19.2,31.93 19.2,38.33 18.29,39.24 17.98,39.24 10.29,46.94 4.72,46.94 R22.2 | v21.79,18.67 22.86,17.6 Q4.C
  Bottom 0.152: v19.2,31.93 19.2,30.71 21.79,28.12 v21.79,18.67
N$6
  Top 0.152: PROGSW.2 78.33,13.11 78.33,15.24 R14.1
N$7
  Top 0.152: U4.7 31.24,39.85 30.4,39.85 27.43,36.88 27.13,36.88 C3.1 27.51,36.88 27.51,33.68 30.71,30.48 Q2.2
N$8
  Top 0.152: 42.29,35.51 42.29,32.38 Q2.1 | 42.29,35.51 42.29,36.8 C13.1 | 42.29,35.51 33.6,35.51 31.32,37.8 31.32,39.09 U4.8
N$9
  Top 0.152: D1.A 80.01,51.05 83.52,51.05 86.64,54.18 87.78,54.18 91.44,57.84 POWER.9 POWER.10
N$10
  Top 0.152: D2.C 86.33,55.7 86.33,57.15 81.31,62.18 POWER.1 81.31,62.26 81.31,64.77 POWER.2
N$11
  Top 0.152: R23.2 4.65,43.13 4.34,43.13 3.66,42.44 2.29,42.44 2.13,42.6 2.13,47.55 6.48,51.89 Q3.C
N$12
  Top 0.152: R10.1 43.66,55.93 43.97,55.93 47.7,59.66 55.85,59.66 MODESW2.2
N$13  (via drill 0.35)
  Top 0.152: v5.79,39.32 4.72,39.32 R24.2 | v8.69,28.5 8.69,11.51 13.95,6.25 Q9.C
  Bottom 0.152: v5.79,39.32 7.62,39.32 8.69,38.25 v8.69,28.5
N$14  (via drill 0.35)
  Top 0.152: v5.79,31.09 5.18,31.7 4.72,31.7 R26.2 | v5.79,26.75 5.79,9.3 8.84,6.25 Q8.C
  Bottom 0.152: v5.79,26.75 v5.79,31.09
N$15
  Top 0.152: R8.1 36.04,64.77 36.04,62.56 37.64,60.96 R13.2 37.72,60.96 40.54,58.14 40.54,57.07 42.82,54.79 47.78,54.79 48.84,53.72 48.84,51.59 53.26,47.17 54.86,47.17 T1.B
N$16
  Top 0.152: Q7.C 3.81,13.49 5.49,15.16 5.49,26.14 4.72,26.9 4.72,27.89 R28.2
N$17
  Top 0.152: R25.2 4.65,35.51 4.65,35.28 1.83,32.46 1.83,17.07 3.81,15.09 Q6.C
N$18
  Top 0.152: R8.2 37.41,64.77 36.65,65.53 28.8,65.53 27.96,64.69 TRIGATEIN.TIP
N$19
  Top 0.152: R30.1 38.79,22.86 43.05,27.13 44.73,27.13 48.84,31.24 48.84,31.77 IC3.7
N$20
  Top 0.152: Q5.C 22.86,14.78 27.28,19.2 27.28,21.11 24.38,24 22.55,24 21.87,24.69 20.57,24.69 20.42,24.54 17.45,24.54 12.88,29.11 4.42,29.11 3.81,28.5 3.81,27.36 4.65,26.52 4.65,24.16 R29.2
N$21
  Top 0.152: R32.1 81.69,32.99 81.69,29.79 80.01,28.12 BUT1.K
N$22
  Top 0.152: R30.2 39.93,22.86 39.17,22.1 37.41,22.1 35.28,24.23 31.55,24.23 31.09,23.77 31.09,3.81 32.54,2.36 56.84,2.36 60.96,6.48 D4.A
N$23
  Top 0.152: D4.C 60.96,11.2 59.89,11.2 52.12,3.43 TRIGOUT2.TIP
N$24
  Top 0.152: R35.2 55.02,19.05 55.02,19.51 51.66,22.86 R34.1 51.59,22.86 51.59,24.38 50.75,25.22 50.75,31.09 51.44,31.77 IC3.5 51.44,31.85 55.55,35.97 55.55,36.8 C14.1
N$31  (via drill 0.35)
  Top 0.152: v68.5,46.86 66.52,48.84 66.52,49.53 R15.1
  Bottom 0.152: v68.5,46.86 79.1,46.86 80.01,45.95 BUT.K
N$32
  Top 0.152: 49.34,25.26 50.14,26.06 50.14,26.59 IC3.3 | 49.34,25.26 49.3,25.22 48.54,25.22 48.31,25.45 48.31,27.66 48.01,27.96 47.24,27.96 43.66,24.38 43.66,22.86 R17.2 43.59,22.86 42.52,21.79 37.26,21.79 35.13,23.93 33.3,23.93 32.23,22.86 C6.1 | 49.34,25.26 50.75,23.85 50.75,22.33 51.59,21.49 51.59,19.05 R16.1
N$33
  Top 0.152: 45.38,20.77 47.62,23.01 IC3.1 | 45.38,20.77 45.34,20.73 45.34,19.05 R18.1 | C6.2 35.74,22.86 37.8,20.8 45.34,20.8 45.38,20.77
N$34
  Top 0.152: R18.2 43.89,19.05 44.62,18.33 | 44.62,18.33 44.65,18.29 49.15,18.29 49.91,19.05 R16.2 | D3.A 41.91,7.09 44.58,9.75 44.58,18.29 44.62,18.33
N$74
  Top 0.152: D3.C 41.91,9.91 39.55,9.91 33.07,3.43 TRIGOUT.TIP
RST
  Top 0.152: U1.29 65.61,44.96 65.61,48.54 63.55,50.6 63.55,55.17 56.54,62.18 45.72,62.18 ISP1.5
RST2  (via drill 0.35)
  Top 0.152: v33.53,48.31 35.13,46.71 35.13,46.25 U4.29
  Bottom 0.152: v33.53,48.31 30.33,48.31 17.68,60.96 ISP2.5
SCK
  Top 0.152: ISP1.3 44.58,63.63 46.1,63.63 48.77,66.29 68.12,66.29 75.97,58.45 75.97,48.69 74.6,47.32 72.92,47.32 69.42,43.81 69.42,38.25 69.8,37.87 70.33,37.87 U1.17
SCK2  (via drill 0.35)
  Top 0.152: v33.6,45.03 36.5,42.14 36.5,41.45 38.79,39.17 39.85,39.17 U4.17
  Bottom 0.152: v33.6,45.03 29.95,45.03 14.02,60.96 ISP2.3
SCL  (via drill 0.35)
  Top 0.152: v35.97,47.4 35.97,46.25 U4.28 | R37.2 39.01,52.05 39.85,52.05 v40.08,51.82 39.93,52.05 v39.93,57.07 | v44.42,61.57 44.42,62.41 45.34,63.32 46.1,63.32 46.94,62.48 56.69,62.48 63.86,55.32 63.86,50.75 66.37,48.23 66.37,44.96 U1.28
  Bottom 0.152: v40.08,51.82 40.08,51.51 v35.97,47.4 | v39.93,57.07 v44.42,61.57
SDA  (via drill 0.35)
  Top 0.152: v38.94,53.11 38.94,55.85 R36.2 | v35.97,48.31 36.73,47.55 36.73,46.25 U4.27 | v67.21,43.59 67.21,44.88 U1.27
  Bottom 0.152: 38.94,52.43 38.94,51.28 v35.97,48.31 | 38.94,52.43 v38.94,53.11 | v67.21,43.59 61.87,38.25 48.31,38.25 44.5,42.06 44.5,48.31 40.39,52.43 38.94,52.43
T1  (via drill 0.35)
  Top 0.152: v58.75,53.8 63.02,49.53 R11.2 63.09,49.53 63.55,49.07 v63.55,48.46 | v63.25,41.91 U1.9
  Bottom 0.152: v58.75,53.8 58.75,61.57 55.93,64.39 MODESW2.3 | v63.25,41.91 63.25,42.22 63.55,42.52 v63.55,48.46
T2
  Top 0.152: 60.92,42.25 61.27,42.6 61.72,42.6 U1.2 | 60.92,42.25 60.88,42.22 60.88,38.94 55.78,33.83 55.78,28.12 56.69,27.2 56.69,22.86 R12.2 | 60.92,42.25 57.84,45.34 57.84,49 55.93,50.9 55.93,54.94 MODESW2.1
T3
  Top 0.152: 72.5,55.44 69.27,58.67 69.27,62.48 67.36,64.39 MODESW1.3 | 72.5,55.44 74.45,53.49 74.45,53.34 R2.2 | 72.5,55.44 73.61,56.54 73.61,57.68 73.84,57.91 75.13,57.91 75.67,57.38 75.67,48.84 74.45,47.62 72.77,47.62 70.1,44.96 68.89,44.96 U1.25
T4
  Top 0.152: 69.46,46.83 68.05,45.41 68.05,44.96 U1.26 | 69.46,46.83 70.56,47.93 74.3,47.93 75.36,49 75.36,53.87 74.52,54.71 74.52,57.15 R3.2 | 69.46,46.83 67.36,48.92 67.36,54.94 MODESW1.1
T5  (via drill 0.35)
  Top 0.152: R5.2 60.43,19.05 65.84,13.64 69.49,13.64 MODESW3.3 | v74.83,37.41 74.83,38.63 70.87,42.6 70.33,42.6 U1.23
  Bottom 0.152: v74.83,37.41 75.44,37.41 81.23,31.62 81.23,30.71 84.2,27.74 84.2,23.09 74.75,13.64 69.57,13.64 MODESW3.3
T6  (via drill 0.35)
  Top 0.152: R6.2 65.46,19.05 66.94,17.56 | 66.94,17.56 68.96,15.54 70.26,15.54 71.48,14.33 71.48,6.1 69.57,4.19 MODESW3.1 | v75.44,36.5 75.44,38.79 70.79,43.43 U1.24 | v66.98,17.6 66.94,17.56
  Bottom 0.152: v75.44,36.5 75.44,31.39 79.02,27.81 79.02,25.15 81,23.16 81,22.25 79.1,20.34 73.99,20.34 73.53,20.8 70.18,20.8 v66.98,17.6
T7  (via drill 0.35)
  Top 0.152: PROGSW.1 89.84,6.4 95.4,11.96 95.4,18.67 94.18,19.89 82.83,19.89 81.99,19.05 R21.2 81.69,19.05 79.48,21.26 v77.65,21.26 | v64.08,35.13 64.08,36.35 U1.10
  Bottom 0.152: v64.08,35.13 64.08,34.82 v77.65,21.26
T8  (via drill 0.35)
  Top 0.152: v83.36,9.37 83.36,15.24 R20.2 | v65.91,38.18 64.85,37.11 U1.11
  Bottom 0.152: PROGSW.3 80.39,6.4 v83.36,9.37 84.51,10.52 84.51,27.89 81.53,30.86 81.53,40.39 80.39,41.53 79.63,41.53 79.02,40.92 79.02,40.77 77.88,39.62 67.51,39.62 66.06,38.18 v65.91,38.18
TRIG  (via drill 0.35)
  Top 0.152: v48.62,38.86 48.62,36.88 R27.1 | v46.86,44.88 45.72,46.02 IC2.3 | v59.66,44.88 63.17,44.88 U1.32
  Bottom 0.152: v48.62,38.86 48.62,43.13 48.58,43.17 | v46.86,44.88 48.58,43.17 | v59.66,44.88 57.61,44.88 55.93,43.2 48.62,43.2 48.58,43.17
TRIGO  (via drill 0.35)
  Top 0.152: R19.2 76.58,36.88 76.58,40.08 76.43,40.23 76.43,41 77.11,41.68 78.87,41.68 80.01,40.54 BUT.A | v66.83,38.02 65.68,36.88 65.68,36.35 U1.12 | v49.23,28.27 48.92,27.96 48.92,26.67 IC3.2
  Bottom 0.152: BUT.A 80.01,40.46 77.57,38.02 v66.83,38.02 66.37,37.57 58.52,37.57 v49.23,28.27

### Text on the board
bNames: From the Workshop of Telescopes | Mineral Fire | V0.3 SMD | Designed by Andy C / Hardware inspired by GMSN! ADSR / Display based on SparkFun / OpenSegment Serial Display | @R2Project / 2018